# Altium schematic sheet 10.SchDoc
size 386 x 246 mm
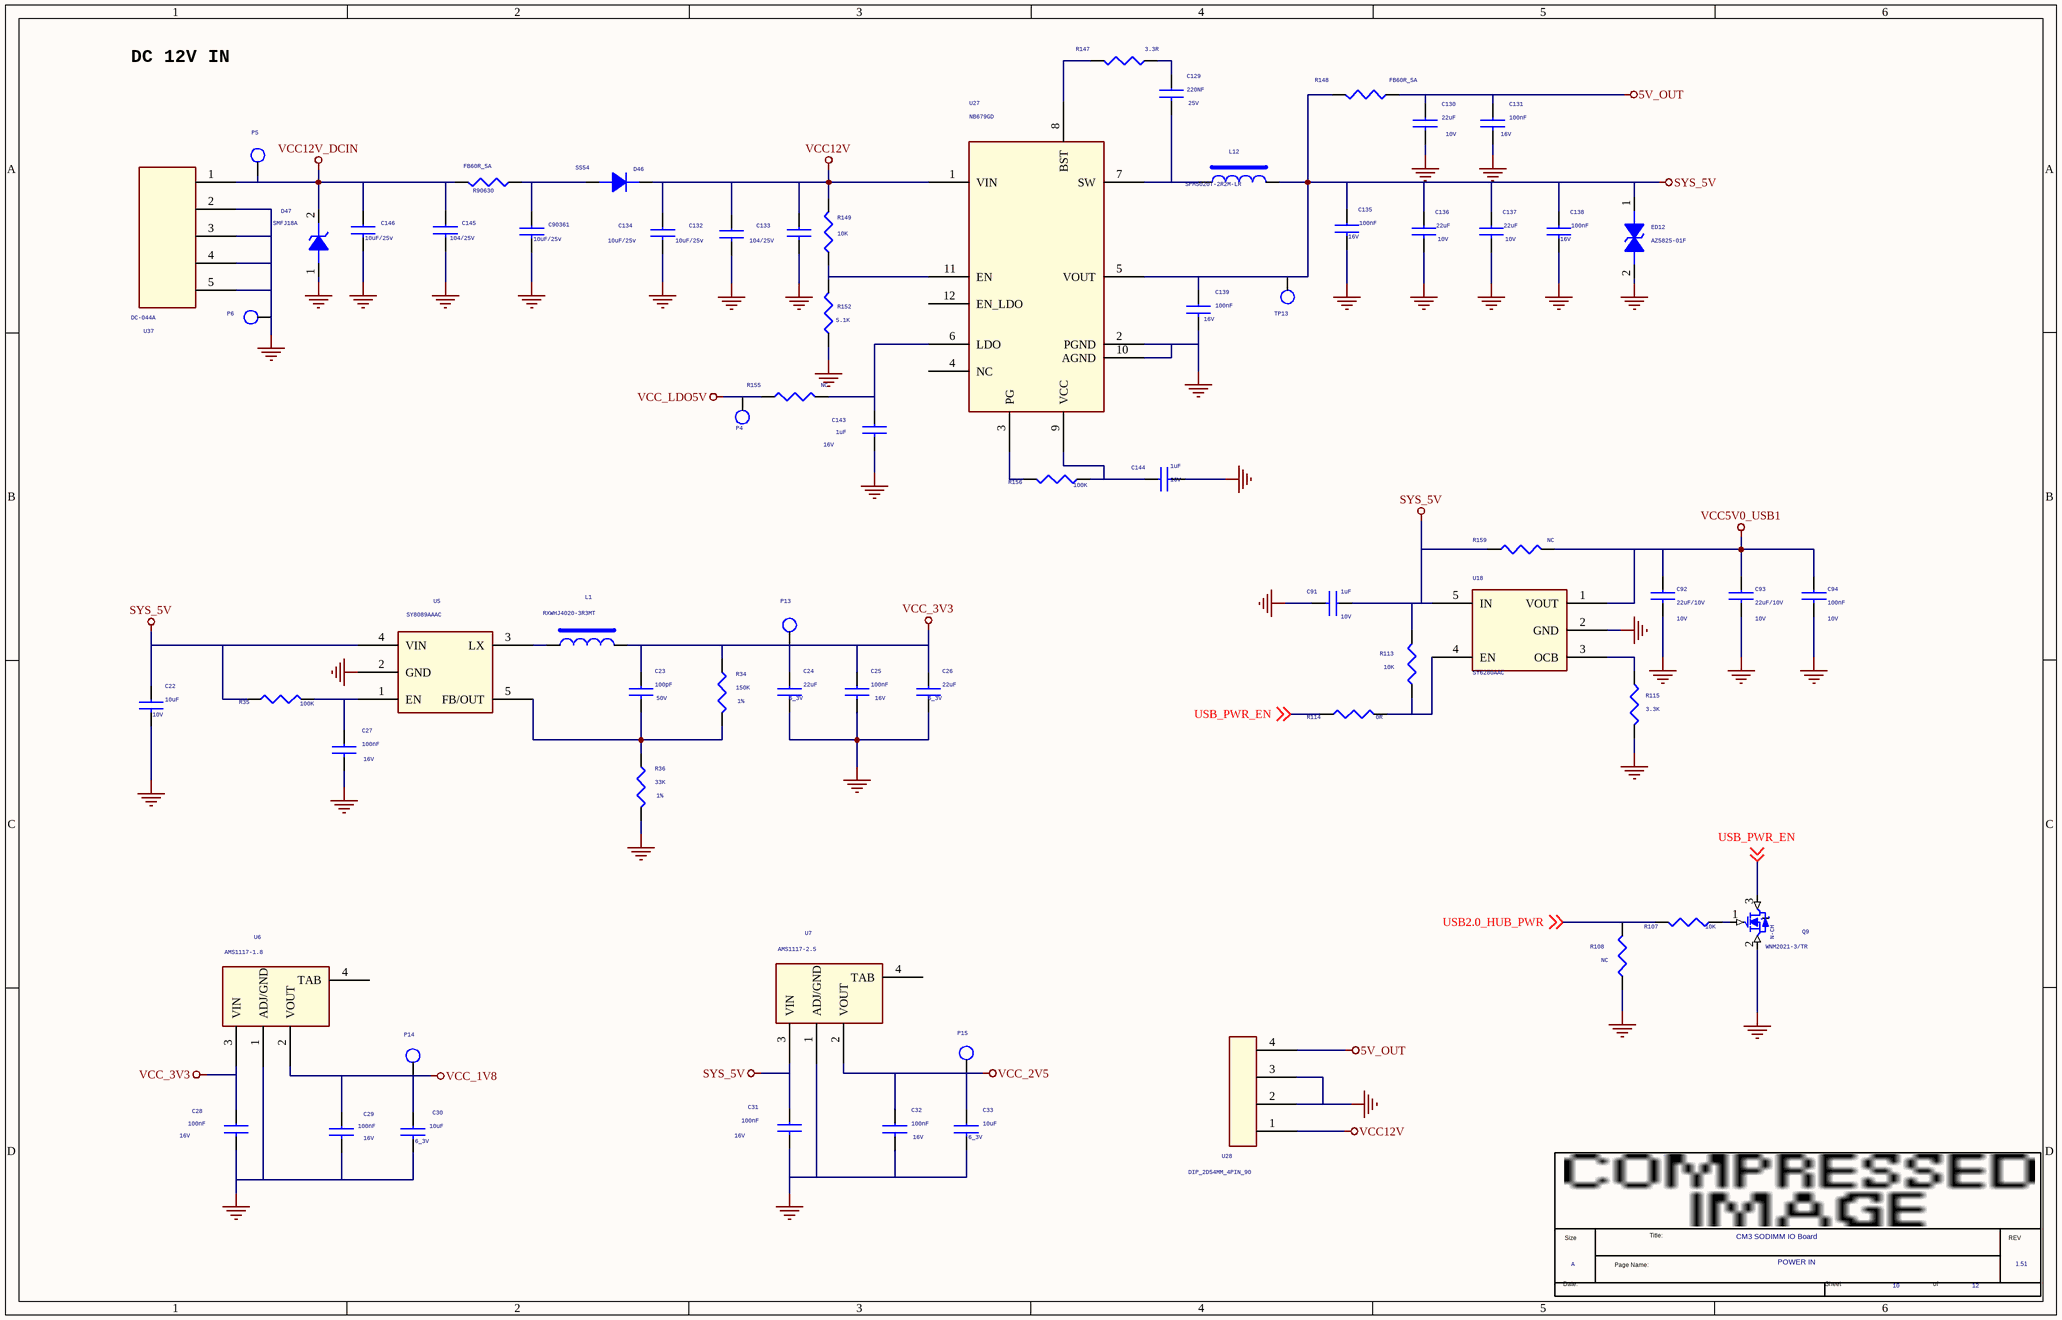
[diagram p0: 10.SchDoc]

## Parts
*  Page Count: 12  Page Number: 10  Page Size: A  Title: CM3 SODIMM IO Board  RevCode: 1.51  Doc: POWER IN  (hidden comment: radxa_1010)  (graphical)
C22  10uF  Voltage: 10V  [C0603]
C23  100pF  Voltage: 50V  [C0402]
C24  22uF  Voltage: 6_3V  [C0603]
C25  100nF  Voltage: 16V  [C0402]
C26  22uF  Voltage: 6_3V  [C0603]
C27  100nF  Voltage: 16V  [C0402]
C28  100nF  Voltage: 16V  [C0402]
C29  100nF  Voltage: 16V  [C0402]
C30  10uF  Voltage: 6_3V  [C0603]
C31  100nF  Voltage: 16V  [C0402]
C32  100nF  Voltage: 16V  [C0402]
C33  10uF  Voltage: 6_3V  [C0603]
C91  1uF  Voltage: 10V  [C0402]
C92  22uF/10V  Voltage: 10V  [C0603]
C93  22uF/10V  Voltage: 10V  [C0603]
C94  100nF  Voltage: 10V  [C0402]
C129  220NF  Voltage: 25V  [C0402]
C130  22uF  Voltage: 10V  [C0603]
C131  100nF  Voltage: 16V  [C0402]
C132  10uF/25v  [C0805]
C133  104/25V  [C0402]
C134  10uF/25v  [C0805]
C135  100nF  Voltage: 16V  [C0402]
C136  22uF  Voltage: 10V  [C0603]
C137  22uF  Voltage: 10V  [C0603]
C138  100nF  Voltage: 16V  [C0402]
C139  100nF  Voltage: 16V  [C0402]
C143  1uF  Voltage: 16V  [C0402]
C144  1uF  Voltage: 16V  [C0402]
C145  104/25V  [C0402]
C146  10uF/25v  [C0805]
C90361  10uF/25v  [C0805]
D46  SS54  [DO_214AC]
D47  SMFJ18A  [SOD_123]
ED12  AZ5825-01F  [ESD0402]
L1  RXWHJ4020-3R3MT  [IND-4X4]
L12  SPM5020T-2R2M-LR  [IND-5020]
P4  TEST  [TEST]  (value not drawn)
P5  TEST  [TEST]  (value not drawn)
P6  TEST  [TEST]  (value not drawn)
P13  TEST  [TEST]  (value not drawn)
P14  TEST  [TEST]  (value not drawn)
P15  TEST  [TEST]  (value not drawn)
Q9  WNM2021-3/TR  [S0T-23]
R34  150K  Tolerance: 1%  [R0402]
R35  100K  [R0402]
R36  33K  Tolerance: 1%  [R0402]
R107  10K  [R0402]
R108  NC  [R0402]
R113  10K  [R0402]
R114  0R  [R0402]
R115  3.3K  [R0402]
R147  3.3R  [R0402]
R148  FB60R_5A  [R1206]
R149  10K  [R0402]
R152  5.1K  [R0402]
R155  NC  [R0402]
R156  100K  [R0402]
R159  NC  [R0402]
R90630  FB60R_5A  [R1206]
TP13  TP_0.7  [TEST]  (value not drawn)
U5  SY8089AAAC  [SOT_23_5]
U6  AMS1117-1.8  [SOT-223]
U7  AMS1117-2.5  [SOT-223]
U18  SY6280AAC  [SOT_23_5]
U27  NB679GD  [QFN12_3R00X2R00X0R90]
U28  DIP_2D54MM_4PIN_90  [XIAO_4PIN_2D54]
U37  DC-044A  [DC-044A]

## Nets
5V_OUT: C130.1 C131.1 R148.1 U28.4
GND: C22.2 C24.2 C25.2 C26.2 C27.2 C28.2 C29.2 C30.2 C31.2 C32.2 C33.2 C91.2 C92.2 C93.2 C94.2 C130.2 C131.2 C132.2 C133.2 C134.2 C135.2 C136.2 C137.2 C138.2 C139.2 C143.2 C144.2 C145.2 C146.2 C90361.2 D47.1(ANODE) ED12.2 P6.1 Q9.2(S) R36.2 R108.2 R115.2 R152.1 U5.2(GND) U6.1(ADJ/GND) U7.1(ADJ/GND) U18.2(GND) U27.2(PGND) U27.10(AGND) U28.2 U28.3 U37.2 U37.3 U37.4 U37.5
SYS_5V: C22.1 C31.1 C91.1 C135.1 C136.1 C137.1 C138.1 C139.1 ED12.1 L12.2 R35.1 R113.1 R148.2 R159.1 TP13.1 U5.4(VIN) U7.3(VIN) U18.5(IN) U27.5(VOUT)
VCC5V0_USB1: C92.1 C93.1 C94.1 R159.2 U18.1(VOUT)
VCC12V: C132.1 C133.1 C134.1 D46.2(K) R149.2 U27.1(VIN) U28.1
VCC12V_DCIN: C145.1 C146.1 D47.2(CATHODE) P5.1 R90630.2 U37.1
VCC_1V8: C29.1 C30.1 P14.1 U6.2(VOUT)
VCC_2V5: C32.1 C33.1 P15.1 U7.2(VOUT)
VCC_3V3: C23.1 C24.1 C25.1 C26.1 C28.1 L1.2 P13.1 R34.1 U6.3(VIN)
VCC_LDO5V: P4.1 R155.1
USB2.0_HUB_PWR: R107.2 R108.1 ; off-sheet USB2.0_HUB_PWR
USB_PWR_EN: Q9.3(D) R114.2 ; off-sheet USB_PWR_EN
NetC23_2: C23.2 R34.2 R36.1 U5.5(FB/OUT)
NetC27_1: C27.1 R35.2 U5.1(EN)
NetC129_1: C129.1 R147.2
NetC129_2: C129.2 L12.1 U27.7(SW)
NetC143_1: C143.1 R155.2 U27.6(LDO)
NetC144_1: C144.1 R156.2 U27.9(VCC)
NetC90361_1: C90361.1 D46.1(A) R90630.1
NetL1_1: L1.1 U5.3(LX)
NetQ9_1: Q9.1(G) R107.1
NetR113_2: R113.2 R114.1 U18.4(EN)
NetR115_1: R115.1 U18.3(OCB)
NetR147_1: R147.1 U27.8(BST)
NetR149_1: R149.1 R152.2 U27.11(EN)
NetR156_1: R156.1 U27.3(PG)

Not connected (* = marked no-connect by the designer): U6 4(TAB); U7 4(TAB); U27 4(NC) 12(EN_LDO)

## Notes on the sheet
- DC 12V IN
- (in symbol N-MOSFET) N-CH
- (in symbol radxa_1010) Size; Title:; REV; Page Name:; Date:; Sheet; of

## Library data of the parts
C22 = CAP NP_0: cap,10.00uF,+/-10%,10V,X5R,C0805; Manufacturer PN: C2012X5R1A106K125AB; Manufacturer: TDK; Tolerance: 10%; C_Voltage: 6.3V; Priority: A; Dielectric: X5R; Created by: JJJ; Part Type: C0805; RK PN: C2012X5R1A106K125AB
C23 = CAP NP_0: cap,100.00pF,+/-10%,50V,C0G,C0402; Manufacturer PN: C1005C0G1H101K050BA; Manufacturer: TDK; C_Voltage: 6.3V; Tolerance: 10%; Priority: A; Number: 37; Dielectric: C0G; Created by: JJJ; Part Type: C0402; RK PN: C1005C0G1H101K050BA
C24 C33 = CAP NP_0: cap,10.00uF,+/-10%,6.3V,X5R,C0603; Manufacturer PN: C1608X5R0J106K080AB; Manufacturer: TDK; Tolerance: 10%; Priority: A; Dielectric: X5R; Created by: JJJ; C_Voltage: 6.3V; Part Type: C0603; RK PN: C1608X5R0J106K080AB
C25 C28 C135 C138 = CAP NP_0: cap,100.00nF,+/-10%,16V,X5R,C0402; Manufacturer: TDK; RK PN: C1005X5R1C104K050BA; Priority: A; Tolerance: 10%; Dielectric: X5R; Part Type: C0402; Manufacturer PN: C1005X5R1C104K050BA; Created by: JJJ
C26 C30 = CAP NP_0: cap,10.00uF,+/-10%,6.3V,X5R,C0603; Manufacturer: TDK; RK PN: C1608X5R0J106K080AB; Priority: A; Tolerance: 10%; Dielectric: X5R; Part Type: C0603; C_Voltage: 6.3V; Manufacturer PN: C1608X5R0J106K080AB; Created by: JJJ
C27 C29 C31 C32 C131 C139 = CAP NP_0: cap,100.00nF,+/-10%,16V,X5R,C0402; Manufacturer PN: C1005X5R1C104K050BA; Manufacturer: TDK; Tolerance: 10%; Priority: A; Dielectric: X5R; Created by: JJJ; Part Type: C0402; RK PN: C1005X5R1C104K050BA
C91 = CAP NP_0: cap,1.00uF,+/-10%,10V,X5R,C0402; Manufacturer PN: C1005X5R1A105K050BB; Manufacturer: TDK; Tolerance: 10%; C_Voltage: 6.3V; Priority: A; Dielectric: X5R; Created by: JJJ; Part Type: C0402; RK PN: C1005X5R1A105K050BB
C92 C93 = CAP NP_0: cap,100.00nF,+/-10%,10V,X5R,C0402; Manufacturer PN: C1005X5R1A104K050BA; Manufacturer: TDK; Tolerance: 10%; Priority: A; Dielectric: X5R; Created by: JJJ; Part Type: C0402; RK PN: C1005X5R1A104K050BA
C94 = CAP NP_0: cap,100.00nF,+/-10%,10V,X5R,C0402; Manufacturer: TDK; RK PN: C1005X5R1A104K050BA; Priority: A; Tolerance: 10%; Dielectric: X5R; Part Type: C0402; Manufacturer PN: C1005X5R1A104K050BA; Created by: JJJ
C129 = CAP NP_0: cap,220.00nF,+/-10%,25V,X5R,C0402; Manufacturer: TDK; RK PN: C1005X5R1E224K050BC; Priority: A; Tolerance: 10%; Dielectric: X5R; Part Type: C0402; Manufacturer PN: C1005X5R1E224K050BC; Created by: JJJ
C130 = CAP NP_0: cap,22.00uF,+/-10%,10V,X5R,C0805; Manufacturer: TDK; RK PN: C2012X5R1A226K125AB; Priority: A; Tolerance: 10%; Dielectric: X5R; Part Type: C0805; Manufacturer PN: C2012X5R1A226K125AB; Created by: JJJ
C132 C134 C146 C90361 = CAP NP_0: cap,10.00uF,+/-10%,16V,X5R,C0805; Manufacturer: TDK; RK PN: C2012X5R1C106K125AC; Priority: A; Tolerance: 10%; Dielectric: X5R; Voltage: 16V; Part Type: C0805; Manufacturer PN: C2012X5R1C106K125AC; Created by: JJJ
C133 = CAP NP_0: cap,1.00uF,+/-10%,16V,X5R,C0402; Manufacturer PN: C1005X5R1C105K050BC; Manufacturer: TDK; Voltage: 25V; Tolerance: 10%; Priority: A; Dielectric: X5R; Created by: JJJ; Part Type: C0402; RK PN: C1005X5R1C105K050BC
C136 C137 = CAP NP_0: cap,22.00uF,+/-10%,10V,X5R,C0805; Manufacturer PN: C2012X5R1A226K125AB; Manufacturer: TDK; Tolerance: 10%; Priority: A; Dielectric: X5R; Created by: JJJ; Part Type: C0805; RK PN: C2012X5R1A226K125AB
C143 C144 = CAP NP_0: cap,1.00uF,+/-10%,16V,X5R,C0402; Manufacturer PN: C1005X5R1C105K050BC; Manufacturer: TDK; Tolerance: 10%; Priority: A; Dielectric: X5R; Created by: JJJ; Part Type: C0402; RK PN: C1005X5R1C105K050BC
C145 = CAP NP_0: cap,1.00uF,+/-10%,16V,X5R,C0402; Manufacturer: TDK; Voltage: 25V; RK PN: C1005X5R1C105K050BC; Priority: A; Tolerance: 10%; Dielectric: X5R; Part Type: C0402; Manufacturer PN: C1005X5R1C105K050BC; Created by: JJJ
D46 = DIODE: Schottky Barrier，SS32 DO214AC; Manufacturer PN: SS32; Manufacturer: 星海; Priority: A; ROOM: CHG; Created by: JJJ; Part Type: Schottky rectifier; RK PN: SS32
D47 = DIODE ZENER1: 1-Line, Uni-directional, Transient Voltage Suppressor; Manufacturer PN: ESD5621W-2/TR; Manufacturer: WillSemi(韦尔半导体); Priority: A; Created by: JJJ; Part Type: ESD_TVS; RK PN: ESD5621W-2/TR
ED12 = DIODE BI_DIR TRIG: Transient Voltage Suppressing Device.Tiny Packge for ESD/Transient Protection; Manufacturer: Amazing（晶焱科技）; Priority: A; RK PN: AZ5825-01F; Part Type: ESD_TVS; Manufacturer PN: AZ5825-01F; Created by: JJJ
L1 = INDUCTORS OF FERRITE_Dup1: Power Inductor,3.3uH,0.2,IND_303015; Manufacturer: sunlord; Isat: 1.32A; DC Resistor: 0.08ohm; RK PN: SWPA3015S3R3MT; Priority: A; Tolerance: 20%; Irms: 1.36A; Resonace frequency: 68M; Part Type: POWER_IND; Manufacturer PN: SWPA3015S3R3MT; Created by: YTL
L12 = INDUCTORS OF FERRITE
P4-P6 P13-P15 = TESTPOINT1
Q9 = N-MOSFET: SANZ_P/N: SK2300; Part Type: MOS管
R34 = RESISTOR_0: 通用厚膜电阻,150K,+/-1%,R0402,1/16W.; Manufacturer: YAGEO; RK PN: RC0402FR-07150KL; Priority: A; Wattage: 1/16W; Part Type: 通用厚膜电阻; Manufacturer PN: RC0402FR-07150KL; Created by: YTL
R35 = RESISTOR_0: 通用厚膜电阻,330K,+/-5%,R0402,1/16W.; Manufacturer PN: RC0402JR-07330KL; Manufacturer: YAGEO; Tolerance: 5%; Wattage: 1/16W; Priority: A; Created by: YTL; Part Type: 通用厚膜电阻; RK PN: RC0402JR-07330KL
R36 = RESISTOR_0: 通用厚膜电阻,33K,+/-1%,R0402,1/16W.; Manufacturer PN: RC0402FR-0733KL; Manufacturer: YAGEO; Wattage: 1/16W; Priority: A; Created by: YTL; Part Type: 通用厚膜电阻; RK PN: RC0402FR-0733KL
R107 = RESISTOR_1: RES,thick film,47KOhm,+/-5%,1/16W,SMD0402
R108 = RESISTOR_0_Dup3: RES,thick film,47KOhm,+/-5%,1/16W,SMD0402; MARK: 51K
R113 = RESISTOR_0: 通用厚膜电阻,4K7,+/-5%,R0402,1/16W.; Manufacturer: YAGEO; Tolerance: 5%; RK PN: RC0402JR-074K7L; Priority: A; Wattage: 1/16W; Part Type: 通用厚膜电阻; Manufacturer PN: RC0402JR-074K7L; Created by: YTL
R114 = RESISTOR_0: 通用厚膜电阻,0R,+/-5%,R0402,1/16W.; Manufacturer PN: RC0402JR-070RL; Manufacturer: YAGEO; Tolerance: 5%; Wattage: 1/16W; Priority: A; Created by: YTL; Part Type: 通用厚膜电阻; RK PN: RC0402JR-070RL
R115 = RESISTOR_0: 通用厚膜电阻,4K7,+/-5%,R0402,1/16W.; Manufacturer PN: RC0402JR-074K7L; Manufacturer: YAGEO; Tolerance: 5%; Wattage: 1/16W; Priority: A; Created by: YTL; Part Type: 通用厚膜电阻; RK PN: RC0402JR-074K7L
R147 = RESISTOR_0: 通用厚膜电阻,3R3,+/-5%,R0402,1/16W.; Manufacturer PN: RC0402JR-073R3L; Manufacturer: YAGEO; Tolerance: 5%; Wattage: 1/16W; Priority: A; Created by: YTL; Part Type: 通用厚膜电阻; RK PN: RC0402JR-073R3L
R148 R90630 = R_0
R149 R152 = RESISTOR_0: 通用厚膜电阻,10K,+/-5%,R0402,1/16W.; Manufacturer PN: RC0402JR-0710KL; Manufacturer: YAGEO; Tolerance: 5%; Wattage: 1/16W; Priority: A; Created by: YTL; Part Type: 通用厚膜电阻; RK PN: RC0402JR-0710KL
R155 R159 = RESISTOR_2: 通用厚膜电阻,10K,+/-5%,R0402,1/16W.; Manufacturer: YAGEO; Tolerance: 5%; RK PN: RC0402JR-0710KL; Priority: A; Wattage: 1/16W; Part Type: 通用厚膜电阻; Manufacturer PN: RC0402JR-0710KL; Created by: YTL
R156 = RESISTOR_0: 通用厚膜电阻,100K,+/-5%,R0402,1/16W.; Manufacturer: YAGEO; Tolerance: 5%; RK PN: RC0402JR-07100KL; Priority: A; Wattage: 1/16W; Part Type: 通用厚膜电阻; Manufacturer PN: RC0402JR-07100KL; Created by: YTL
TP13 = TP: Test Point 0.7mm; Priority: A; RK PN: TESTPOINT_0R7; Created by: JJJ; Part Type: TP
U5 = DCDC_SY8088: 1A, 1.5MHz Step-Down Converter in SOT23-5 Package; Manufacturer PN: ETA3486; option: /SY8088AAC/PT3406; Priority: A; Created by: JJJ; Part Type: DCDC; RK PN: ETA3486
U6 U7 = CON3_2_Dup1
U18 = SWITCH_SY6280: Low Loss Power Distribution Switch; Manufacturer: Silergy（矽力杰）; Priority: A; RK PN: SY6280AAC; Part Type: Switch; Manufacturer PN: SY6280AAC; Created by: JJJ
U27 = DCDC_NB679: 26 V, Low Iq, High Current, Fixed 5 V-8 A Synchronous Buck Converter with 100 mA LDO;; Manufacturer: MPS （美国芯源）; RK PN: NB679GD; Priority: A; Part Type: DCDC; Manufacturer PN: NB679GD; Created by: JJJ
U28 = CON3_2
U37 = CON3_6
* = radxa_1010: Page Create Date: March  8, 1995